# Altium schematic sheet NNP-DWG-165-001-000 BP2 Modular and TGest Header Pg 6 of 6.SchDoc
size 431 x 279 mm; Organization: ORGANIZATION; Address1: ADDRESS 1; Address2: ADDRESS 2; Address3: ADDRESS 3; Address4: ADDRESS 4; Revision: -; SheetNumber: 3; SheetTotal: 6; ENG_APP_DATE: --/--/--; DSN_APP_DATE: --/--/--; CHK_APP_DATE: --/--/--
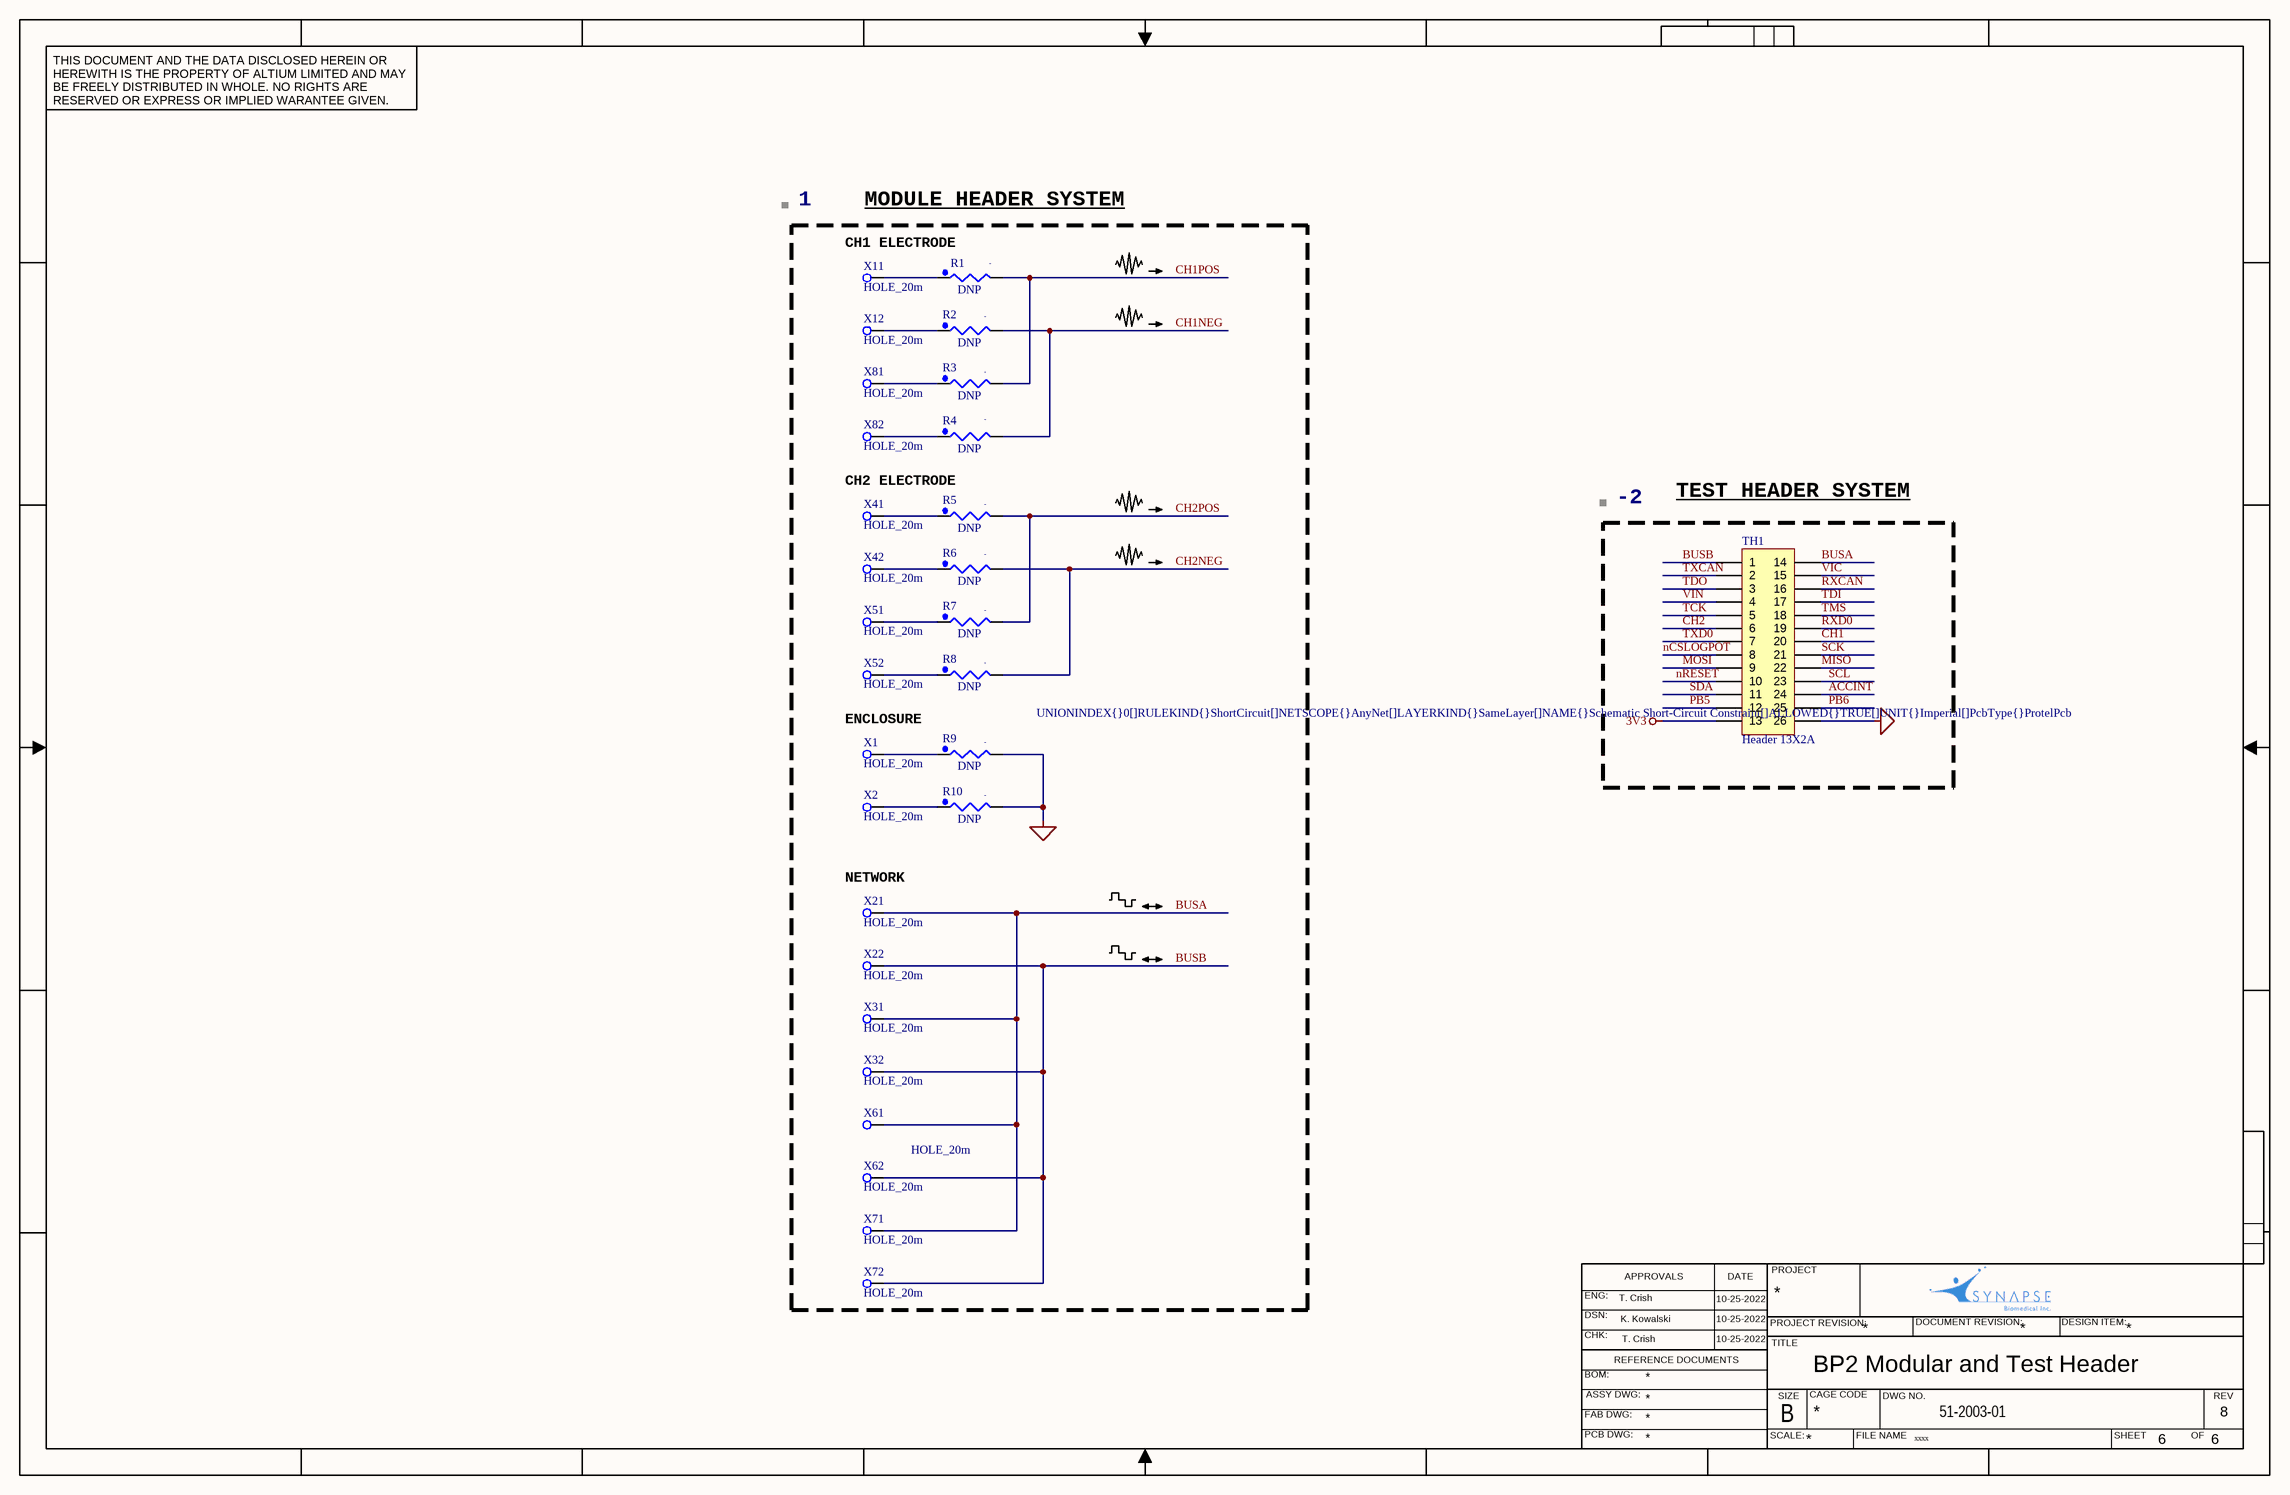
[diagram p0: NNP-DWG-165-001-000 BP2 Modular and TGest Header Pg 6 of 6.SchDoc]

## Parts
1  XDESCRIPTION: MODULE HEADER SYSTEM  (hidden comment: BOM_S1)  (graphical)
-2  XDESCRIPTION: TEST HEADER SYSTEM  (hidden comment: BOM_S1)  (graphical)
R1  DNP  [RES_0402_cut]  (no BOM)
R2  DNP  [RES_0402_cut]  (no BOM)
R3  Rule: UNIONINDEX{}0[]RULEKIND{}ShortCircuit[]NETSCOPE{}AnyNet[]LAYERKIND{}SameLayer[]NAME{}Schematic Short-Circuit Constraint[]ALLOWED{}TRUE[]UNIT{}Imperial[]PcbType{}ProtelPcb  [RES_0402_cut]  (hidden comment: DNP)  (no BOM)
R4  DNP  [RES_0402_cut]  (no BOM)
R5  DNP  [RES_0402_cut]  (no BOM)
R6  DNP  [RES_0402_cut]  (no BOM)
R7  DNP  [RES_0402_cut]  (no BOM)
R8  DNP  [RES_0402_cut]  (no BOM)
R9  DNP  [RES_0402_cut]  (no BOM)
R10  DNP  [RES_0402_cut]  (no BOM)
TH1  Header 13X2A  [HDR2X13_CEN]
X1  HOLE_20m  [FEEDHOLE_20mil]  (no BOM)
X2  HOLE_20m  [FEEDHOLE_20mil]  (no BOM)
X11  HOLE_20m  [FEEDHOLE_20mil]  (no BOM)
X12  HOLE_20m  [FEEDHOLE_20mil]  (no BOM)
X21  HOLE_20m  [FEEDHOLE_20mil]  (no BOM)
X22  HOLE_20m  [FEEDHOLE_20mil]  (no BOM)
X31  HOLE_20m  [FEEDHOLE_20mil]  (no BOM)
X32  HOLE_20m  [FEEDHOLE_20mil]  (no BOM)
X41  HOLE_20m  [FEEDHOLE_20mil]  (no BOM)
X42  HOLE_20m  [FEEDHOLE_20mil]  (no BOM)
X51  HOLE_20m  [FEEDHOLE_20mil]  (no BOM)
X52  HOLE_20m  [FEEDHOLE_20mil]  (no BOM)
X61  HOLE_20m  [FEEDHOLE_20mil]  (no BOM)
X62  HOLE_20m  [FEEDHOLE_20mil]  (no BOM)
X71  HOLE_20m  [FEEDHOLE_20mil]  (no BOM)
X72  HOLE_20m  [FEEDHOLE_20mil]  (no BOM)
X81  HOLE_20m  [FEEDHOLE_20mil]  (no BOM)
X82  HOLE_20m  [FEEDHOLE_20mil]  (no BOM)

## Nets
3V3: TH1.13
GND: R9.2 R10.2 TH1.26
ACCINT: TH1.24
BUSA: TH1.14 X21.1 X31.1 X61.1 X71.1
BUSB: TH1.1 X22.1 X32.1 X62.1 X72.1
CH1: TH1.20
CH1NEG: R2.2 R4.2
CH1POS: R1.2 R3.2
CH2: TH1.6
CH2NEG: R6.2 R8.2
CH2POS: R5.2 R7.2
MISO: TH1.22
MOSI: TH1.9
nCSLOGPOT: TH1.8
nRESET: TH1.10
PB5: TH1.12
PB6: TH1.25
RXCAN: TH1.16
RXD0: TH1.19
SCK: TH1.21
SCL: TH1.23
SDA: TH1.11
TCK: TH1.5
TDI: TH1.17
TDO: TH1.3
TMS: TH1.18
TXCAN: TH1.2
TXD0: TH1.7
VIC: TH1.15
VIN: TH1.4
NetR1_1: R1.1 X11.1
NetR2_1: R2.1 X12.1
NetR3_1: R3.1 X81.1
NetR4_1: R4.1 X82.1
NetR5_1: R5.1 X41.1
NetR6_1: R6.1 X42.1
NetR7_1: R7.1 X51.1
NetR8_1: R8.1 X52.1
NetR9_1: R9.1 X1.1
NetR10_1: R10.1 X2.1

## Notes on the sheet
- THIS DOCUMENT AND THE DATA DISCLOSED HEREIN OR HEREWITH IS THE PROPERTY OF ALTIUM LIMITED AND MAY BE FREELY DISTRIBUTED IN WHOLE. NO RIGHTS ARE RESERVED OR EXPRESS OR IMPLIED WARANTEE GIVEN.
- CH1 ELECTRODE
- CH2 ELECTRODE
- ENCLOSURE
- (near X21) NETWORK
- ENG:
- T. Crish
- APPROVALS
- 10-25-2022
- DATE
- PROJECT
- DSN:
- CHK:
- REFERENCE DOCUMENTS
- K. Kowalski
- PROJECT REVISION:
- TITLE
- *
- DOCUMENT REVISION:
- BP2 Modular and Test Header
- DESIGN ITEM:
- BOM:
- FAB DWG:
- PCB DWG:
- ASSY DWG:
- SCALE:
- SIZE
- B
- CAGE CODE
- FILE NAME
- DWG NO.
- 51-2003-01
- SHEET
- OF
- REV
- 8
- xxxx
- 6

## Library data of the parts
1 -2 = BOM_S1: BOM item small graphic
R1 R2 R4 R5 R7-R10 = MCR01MZPJ000: 0.0 ohm, 1/16W, 0402, RoHS; Rule: UNIONINDEX{}0[]RULEKIND{}ShortCircuit[]NETSCOPE{}AnyNet[]LAYERKIND{}SameLayer[]NAME{}Schematic Short-Circuit Constraint[]ALLOWED{}TRUE[]UNIT{}Imperial[]PcbType{}ProtelPcb; MFR: -; PackageDescription: -; Supplier 1: -; Supplier Part Number 1: -; MPN: -; Value: DNP
R3 = MCR01MZPJ000: 0.0 ohm, 1/16W, 0402, RoHS; MFR: -; PackageDescription: -; Supplier 1: -; Supplier Part Number 1: -; MPN: -; Value: DNP
R6 = MCR01MZPJ000: 0.0 ohm, 1/16W, 0402, RoHS; Rule: UNIONINDEX{}0[]RULEKIND{}ShortCircuit[]NETSCOPE{}AnyNet[]LAYERKIND{}SameLayer[]NAME{}Schematic Short-Circuit Constraint[]ALLOWED{}TRUE[]UNIT{}Imperial[]PcbType{}ProtelPcb; Rule: PcbType=ProtelPcb; MFR: -; PackageDescription: -; Supplier 1: -; Supplier Part Number 1: -; MPN: -; Value: DNP
TH1 = Header 13X2A: Header, 13-Pin, Dual row; LatestRevisionDate: 17-Jul-2002; LatestRevisionNote: Re-released for DXP Platform.; Publisher: Altium Limited
X1 X2 X11 X12 X21 X22 X31 X32 X41 X42 X51 X52 X61 X62 X71 X72 X81 X82 = HOLE_20m: Hole for 10mil diameter feedthrough; Note: Hole for 10mil diameter feedthrough; PackageDescription: Thru-Hole